# Altium schematic sheet [07] - PCIE MINI.SchDoc
size A2; DocumentNumber: 7; SheetNumber: 7; SheetTotal: 18
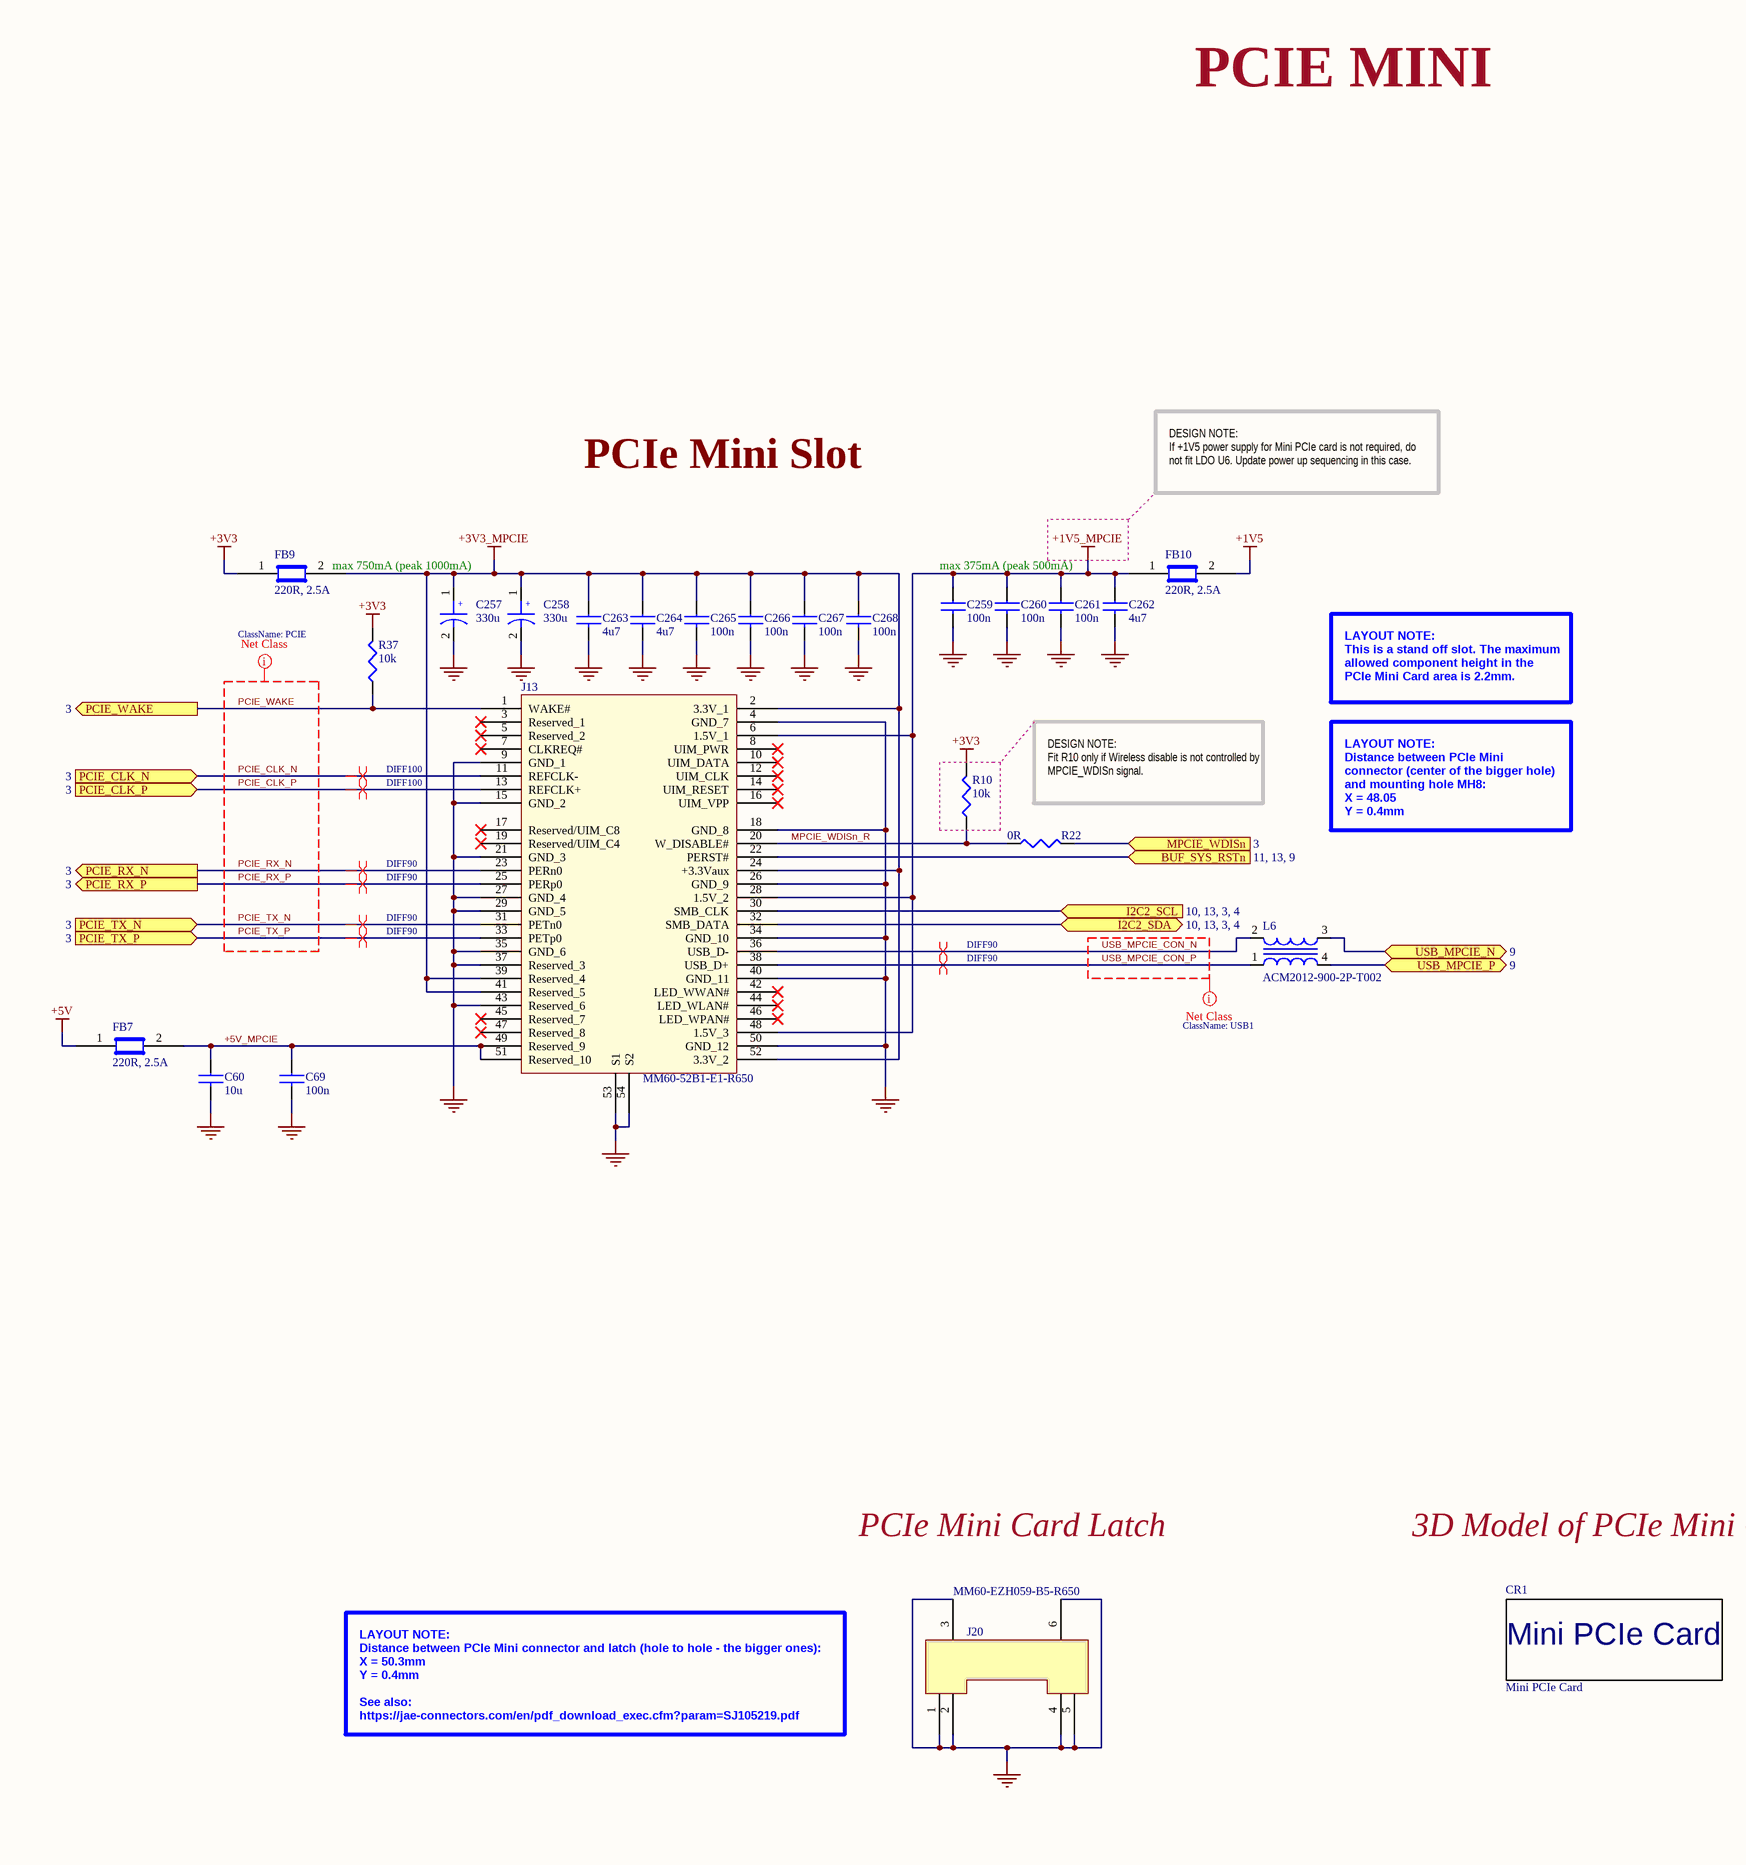
[diagram p0: [07] - PCIE MINI.SchDoc, left]
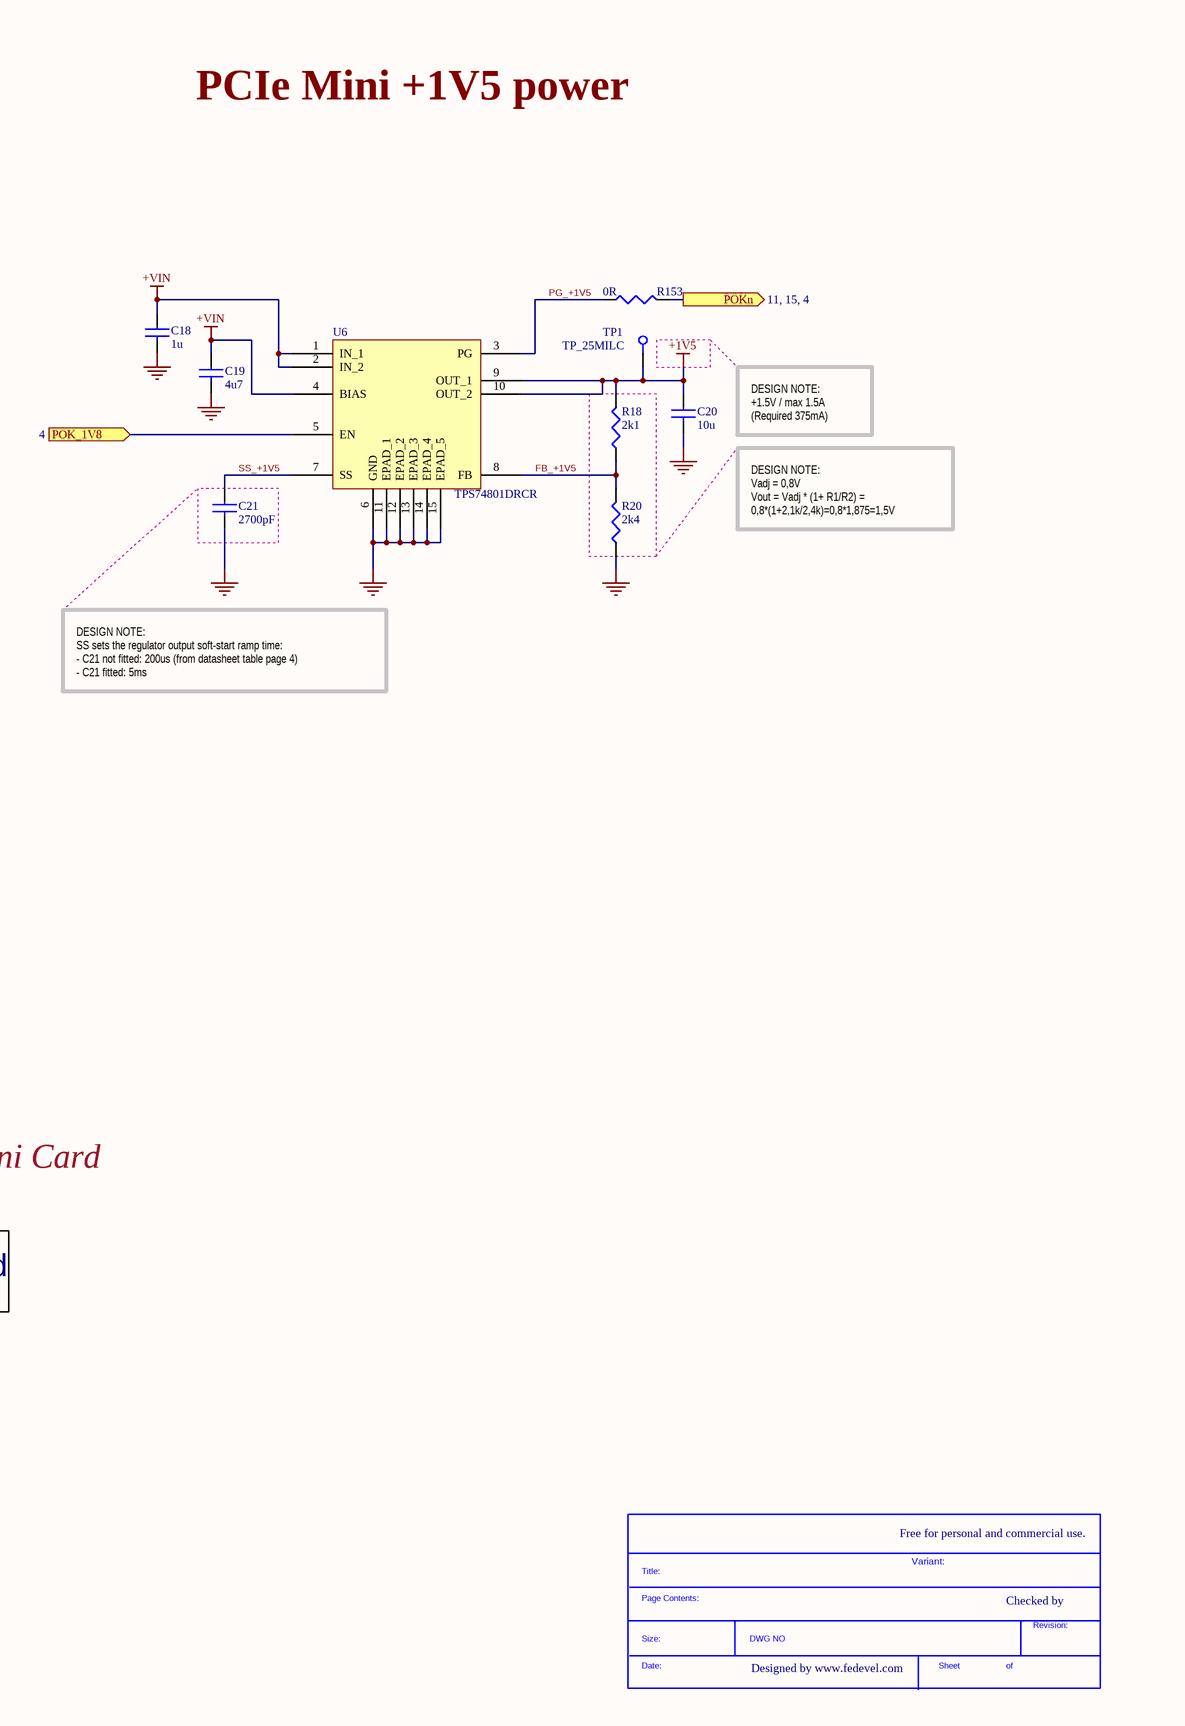
[diagram p1: [07] - PCIE MINI.SchDoc, right]

## Parts
*  SDTitleBlock  (value not drawn)  (graphical)
C18  1u  [C0402]
C19  4u7  [C0402]
C20  10u  [C0603]
C21  2700pF  [C0402]
C60  10u  [C0603]
C69  100n  [C0402]
C257  330u  [C2917]
C258  330u  [C2917]
C259  100n  [C0402]
C260  100n  [C0402]
C261  100n  [C0402]
C262  4u7  [C0402]
C263  4u7  [C0402]
C264  4u7  [C0402]
C265  100n  [C0402]
C266  100n  [C0402]
C267  100n  [C0402]
C268  100n  [C0402]
CR1  Mini PCIe Card  [Mini_PCIe_full card]  (no BOM)
FB7  220R, 2.5A  [C0603]
FB9  220R, 2.5A  [C0603]
FB10  220R, 2.5A  [C0603]
J13  MM60-52B1-E1-R650  [MINI_PCIE_52PIN_CARD_CON]
J20  MM60-EZH059-B5-R650  [MINI_PCIE_52PIN_CARD_LATCH]
L6  ACM2012-900-2P-T002  [ACM2012]
R10  10k  [R0402]
R18  2k1  [R0402]
R20  2k4  [R0402]
R22  0R  [R0402]
R37  10k  [R0402]
R153  0R  [R0402]
TP1  TP_25MILC  [TP_25C]  (no BOM)
U6  TPS74801DRCR  [DRC (S-PVSON-N10)]

## Ports
BUF_SYS_RSTn (see 11, 13, 9), I2C2_SCL (see 10, 13, 3, 4), I2C2_SDA (bidir, see 10, 13, 3, 4), MPCIE_WDISn (in, see 3), PCIE_CLK_N (in, see 3), PCIE_CLK_P (in, see 3), PCIE_RX_N (out, see 3), PCIE_RX_P (out, see 3), PCIE_TX_N (in, see 3), PCIE_TX_P (in, see 3), PCIE_WAKE (out, see 3), POK_1V8 (in, see 4), POKn (see 11, 15, 4), USB_MPCIE_N (bidir, see 9), USB_MPCIE_P (bidir, see 9)

## Nets
+1V5: C20.1 FB10.2 R18.2 TP1.1 U6.9(OUT_1) U6.10(OUT_2)
+1V5_MPCIE: C259.1 C260.1 C261.1 C262.1 FB10.1 J13.6(1.5V_1) J13.28(1.5V_2) J13.48(1.5V_3)
+3V3: FB9.1 R10.2 R37.2
+3V3_MPCIE: C257.1 C258.1 C263.1 C264.1 C265.1 C266.1 C267.1 C268.1 FB9.2 J13.2(3.3V_1) J13.24(+3.3Vaux) J13.39(Reserved_4) J13.41(Reserved_5) J13.52(3.3V_2)
+5V: FB7.1
+VIN: C18.1 C19.1 U6.1(IN_1) U6.2(IN_2) U6.4(BIAS)
GND: C18.2 C19.2 C20.2 C21.2 C60.2 C69.2 C257.2 C258.2 C259.2 C260.2 C261.2 C262.2 C263.2 C264.2 C265.2 C266.2 C267.2 C268.2 J13.4(GND_7) J13.9(GND_1) J13.15(GND_2) J13.18(GND_8) J13.21(GND_3) J13.26(GND_9) J13.27(GND_4) J13.29(GND_5) J13.34(GND_10) J13.35(GND_6) J13.37(Reserved_3) J13.40(GND_11) J13.43(Reserved_6) J13.50(GND_12) J13.53(S1) J13.54(S2) J20.1 J20.2 J20.3 J20.4 J20.5 J20.6 R20.1 U6.6(GND) U6.11(EPAD_1) U6.12(EPAD_2) U6.13(EPAD_3) U6.14(EPAD_4) U6.15(EPAD_5)
+5V_MPCIE: C60.1 C69.1 FB7.2 J13.49(Reserved_9) J13.51(Reserved_10)
BUF_SYS_RSTn: J13.22(PERST#) ; port BUF_SYS_RSTn
FB_+1V5: R18.1 R20.2 U6.8(FB)
I2C2_SCL: J13.30(SMB_CLK) ; port I2C2_SCL
I2C2_SDA: J13.32(SMB_DATA) ; port I2C2_SDA
MPCIE_WDISn: R22.2 ; port MPCIE_WDISn
MPCIE_WDISn_R: J13.20(W_DISABLE#) R10.1 R22.1
PCIE_CLK_N: J13.11(REFCLK-) ; port PCIE_CLK_N
PCIE_CLK_P: J13.13(REFCLK+) ; port PCIE_CLK_P
PCIE_RX_N: J13.23(PERn0) ; port PCIE_RX_N
PCIE_RX_P: J13.25(PERp0) ; port PCIE_RX_P
PCIE_TX_N: J13.31(PETn0) ; port PCIE_TX_N
PCIE_TX_P: J13.33(PETp0) ; port PCIE_TX_P
PCIE_WAKE: J13.1(WAKE#) R37.1 ; port PCIE_WAKE
PG_+1V5: R153.1 U6.3(PG)
POK_1V8: U6.5(EN) ; port POK_1V8
POKn: R153.2 ; port POKn
SS_+1V5: C21.1 U6.7(SS)
USB_MPCIE_CON_N: J13.36(USB_D-) L6.2
USB_MPCIE_CON_P: J13.38(USB_D+) L6.1
USB_MPCIE_N: L6.3 ; port USB_MPCIE_N
USB_MPCIE_P: L6.4 ; port USB_MPCIE_P

Not connected (* = marked no-connect by the designer): J13 3(Reserved_1)* 5(Reserved_2)* 7(CLKREQ#)* 8(UIM_PWR)* 10(UIM_DATA)* 12(UIM_CLK)* 14(UIM_RESET)* 16(UIM_VPP)* 17(Reserved/UIM_C8)* 19(Reserved/UIM_C4)* 42(LED_WWAN#)* 44(LED_WLAN#)* 45(Reserved_7)* 46(LED_WPAN#)* 47(Reserved_8)*

## Layout directives
differential pair; net class DIFF90: PCIE_RX_N, PCIE_RX_P, PCIE_TX_N, PCIE_TX_P, USB_MPCIE_CON_N, USB_MPCIE_CON_P
net class USB1: USB_MPCIE_CON_N, USB_MPCIE_CON_P
differential pair; net class DIFF100: PCIE_CLK_N, PCIE_CLK_P
net class PCIE: PCIE_CLK_N, PCIE_CLK_P, PCIE_RX_N, PCIE_RX_P, PCIE_TX_N, PCIE_TX_P, PCIE_WAKE

## Notes on the sheet
- PCIE MINI
- PCIe Mini Slot
- DESIGN NOTE:
  If +1V5 power supply for Mini PCIe card is not required, do not fit LDO U6. Update power up sequencing in this case.
- PCIe Mini +1V5 power
- max 750mA (peak 1000mA)
- max 375mA (peak 500mA)
- LAYOUT NOTE:
  This is a stand off slot. The maximum allowed component height in the PCIe Mini Card area is 2.2mm.
- (near R22) DESIGN NOTE:
  Fit R10 only if Wireless disable is not controlled by MPCIE_WDISn signal.
- LAYOUT NOTE:
  Distance between PCIe Mini connector (center of the bigger hole) and mounting hole MH8:
  X = 48.05
  Y = 0.4mm
- DESIGN NOTE:
  +1.5V / max 1.5A
  (Required 375mA)
- DESIGN NOTE:
  Vadj = 0,8V
  Vout = Vadj * (1+ R1/R2) = 0,8*(1+2,1k/2,4k)=0,8*1,875=1,5V
- DESIGN NOTE:
  SS sets the regulator output soft-start ramp time:
  - C21 not fitted: 200us (from datasheet table page 4)
  - C21 fitted: 5ms
- PCIe Mini Card Latch
- 3D Model of PCIe Mini Card
- LAYOUT NOTE:
  Distance between PCIe Mini connector and latch (hole to hole - the bigger ones):
  X = 50.3mm
  Y = 0.4mm
  See also:
  https://jae-connectors.com/en/pdf_download_exec.cfm?param=SJ105219.pdf
- Free for personal and commercial use.
- Variant:
- Checked by
- Designed by www.fedevel.com
- (in symbol SDTitleBlock) Title:; Page Contents:; Revision:; Size:; DWG NO; Date:; Sheet; of
- (in symbol T520D337M006ATE045) +

## Library data of the parts
C18 = C1005X5R1C105K: CAP CER 1.0UF 16V X5R 0402; Manufacturer: TDK Corporation; Capacitance: 1.0µF; Value: 1uF; .Checked PCB: used; Tolerance: ±10%; Category: Capacitors; Supplier Part Number: 445-4978-1-ND; Manufacturer Part Number: C1005X5R1C105K; Operating Temperature: -55°C ~ 85°C; Package / Case: 0402 (1005 Metric); Price 1k [$]: 0.02080; .Checked SCH: used; Voltage - Rated: 16V; Supplier: Digikey; Supplier 1: Digi-Key; Supplier Part Number 1: 445-4978-1-ND; RoHS: RoHS Compliant; Stock 1: 341010; Pricing 1: 1=0.24, 10=0.16, 100=0.064, 250=0.046, 500=0.0328, 1000=0.024 (USD); Temperature Coefficient: X5R; Mounting Type: Surface Mount, MLCC; Applications: General Purpose; Ratings: -; Size / Dimension: 0.039" L x 0.020" W (1.00mm x 0.50mm); Height - Seated (Max): -; Thickness (Max): 0.022" (0.55mm); Lead Spacing: -; Features: -; Packaging: Cut Tape (CT); Lead Style: -; ComponentLink1URL: http://www.tdk.co.jp/tefe02/e412_c.pdf; ComponentLink1Description: http://www.tdk.co.jp/tefe02/e412_c.pdf
C19 C262-C264 = C1005X5R1A475M: CAP CER 4.7UF 10V 20% X5R 0402; Manufacturer: TDK Corporation; Capacitance: 4.7µF; .Checked PCB: used; Supplier 1: Digi-Key; Supplier Part Number 1: 445-8023-1-ND; Manufacturer Part Number: C1005X5R1A475M; RoHS: RoHS Compliant; Category: Capacitors; Stock 1: 10140; Pricing 1: 1=0.53, 10=0.415, 100=0.25, 250=0.18752, 500=0.16, 1000=0.125, 5000=0.095 (USD); Voltage - Rated: 10V; Tolerance: ±20%; Temperature Coefficient: X5R; Mounting Type: Surface Mount, MLCC; Operating Temperature: -55°C ~ 85°C; Applications: General Purpose; Ratings: -; Package / Case: 0402 (1005 Metric); Size / Dimension: 0.039" L x 0.020" W (1.00mm x 0.50mm); Height - Seated (Max): -; Thickness (Max): -; Lead Spacing: -; Features: -; Packaging: Cut Tape (CT); Lead Style: -; ComponentLink1URL: http://www.tdk.com/pdf/general_B11.pdf; ComponentLink1Description: http://www.tdk.com/pdf/general_B11.pdf; .Checked SCH: used
C20 C60 = C1608X5R0J106M: CAP CER 10UF 6.3V X5R 20% 0603; Manufacturer: TDK Corporation; Capacitance: 10µF; Value: 10µF; .Checked PCB: used; Category: Capacitors; Supplier Part Number: 445-4112-1-ND; Manufacturer Part Number: C1608X5R0J106M; Operating Temperature: -55°C ~ 85°C; Package / Case: 0603 (1608 Metric); Price 1k [$]: 0.08580; .Checked SCH: used; Voltage - Rated: 6.3V; Features: Low ESR; Supplier: Digikey; Supplier 1: Digi-Key; Supplier Part Number 1: 445-4112-1-ND; RoHS: RoHS Compliant; Stock 1: 48157; Pricing 1: 1=0.46, 10=0.363, 100=0.1898, 250=0.14024, 500=0.1089, 1000=0.0858 (USD); Tolerance: ±20%; Temperature Coefficient: X5R; Mounting Type: Surface Mount, MLCC; Applications: General Purpose; Ratings: -; Size / Dimension: 0.063" L x 0.031" W (1.60mm x 0.80mm); Height - Seated (Max): -; Thickness (Max): 0.037" (0.95mm); Lead Spacing: -; Packaging: Cut Tape (CT); Lead Style: -; ComponentLink1URL: http://www.tdk.com/pdf/general_B11.pdf; ComponentLink1Description: http://www.tdk.com/pdf/general_B11.pdf
C21 = GRM155R71H272KA01D: CAP CER 2700PF 50V 10% X7R 0402; Manufacturer: Murata Electronics North America; .Checked PCB: used; Supplier 1: Digi-Key; Supplier Part Number 1: 490-1306-1-ND; Manufacturer Part Number: GRM155R71H272KA01D; RoHS: RoHS Compliant; Category: Capacitors; Stock 1: 38160; Pricing 1: 10=0.01, 50=0.0086, 100=0.0074, 250=0.00664, 500=0.00618, 750=0.00571, 1000=0.00542 (USD); Capacitance: 2700pF; Voltage - Rated: 50V; Tolerance: ±10%; Temperature Coefficient: X7R; Mounting Type: Surface Mount, MLCC; Operating Temperature: -55°C ~ 125°C; Applications: General Purpose; Ratings: -; Package / Case: 0402 (1005 Metric); Size / Dimension: 0.039" L x 0.020" W (1.00mm x 0.50mm); Height - Seated (Max): -; Thickness (Max): 0.022" (0.55mm); Lead Spacing: -; Features: -; Packaging: Cut Tape (CT); Lead Style: -; ComponentLink1URL: http://search.murata.co.jp/Ceramy/image/img/PDF/ENG/GRM155R71H272KA01.pdf; ComponentLink1Description: http://search.murata.co.jp/Ceramy/image/img/PDF/ENG/GRM155R71H272KA01.pdf; .Checked SCH: used
C69 C259-C261 C265-C268 = C1005X5R1H104K: CAP CER .10UF 50V X5R 10% 0402; Manufacturer: TDK Corporation; Capacitance: 0.1µF; Value: 100nF; .Checked PCB: used; Category: Capacitors; Supplier Part Number: 445-5942-1-ND; Manufacturer Part Number: C1005X5R1H104K; Operating Temperature: -55°C ~ 85°C; Package / Case: 0402 (1005 Metric); Price 1k [$]: 0.02340; .Checked SCH: used; Voltage - Rated: 50V; Supplier: Digikey; Supplier 1: Digi-Key; Supplier Part Number 1: 445-5942-1-ND; RoHS: RoHS Compliant; Stock 1: 106926; Pricing 1: 1=0.27, 10=0.18, 100=0.072, 250=0.05176, 500=0.0369, 1000=0.027 (USD); Tolerance: ±10%; Temperature Coefficient: X5R; Mounting Type: Surface Mount, MLCC; Applications: General Purpose; Ratings: -; Size / Dimension: 0.039" L x 0.020" W (1.00mm x 0.50mm); Height - Seated (Max): -; Thickness (Max): 0.022" (0.55mm); Lead Spacing: -; Features: -; Packaging: Cut Tape (CT); Lead Style: -; ComponentLink1URL: http://www.tdk.co.jp/tefe02/e412_c.pdf; ComponentLink1Description: http://www.tdk.co.jp/tefe02/e412_c.pdf
C257 C258 = T520D337M006ATE045: CAP TANT 330UF 6.3V 20% 2917; Manufacturer: Kemet; Manufacturer Size Code: D; Capacitance: 330µF; ESR (Equivalent Series Resistance): 45 mOhm; Type: Molded; .Creator: MM; .Checked PCB: used; Supplier 1: Digi-Key; Manufacturer Part Number: T520D337M006ATE045; RoHS: RoHS Compliant; Category: Capacitors; Stock 1: 11758; Pricing 1: 1=1.33, 10=1.05, 50=0.91, 100=0.7875, 250=0.7 (USD); Packaging: Cut Tape (CT); Voltage - Rated: 6.3V; Tolerance: ±20%; Operating Temperature: -55°C ~ 105°C; Mounting Type: Surface Mount; Package / Case: 2917 (7343 Metric); Size / Dimension: 0.287" L x 0.169" W (7.30mm x 4.30mm); Height - Seated (Max): 0.122" (3.10mm); Lead Spacing: -; Features: Polymer; Lifetime @ Temp.: -; ComponentLink1URL: http://www.kemet.com/kemet/web/homepage/kechome.nsf/file/T520%20Series/$file/KEM_T2015_T520.pdf; ComponentLink1Description: http://www.kemet.com/kemet/web/homepage/kechome.nsf/file/T520%20Series/$file/KEM_T2015_T520.pdf; Supplier Part Number 1: 399-4055-1-ND; .Checked SCH: used
CR1 = Card_Mini_PCIe: Card MIni PCIe; .Creator: MM; Category: Card
FB7 FB9 FB10 = BLM18SG221TN1D: FERRITE CHIP 220 OHM 2500MA 0603; Manufacturer: Murata Electronics North America; Impedance @ Frequency: 220 Ohm @ 100MHz; DC Resistance (DCR): 40 mOhm Max; Filter Type: Differential Mode - Single; Number of Lines: 1; .Checked PCB: used; Supplier 1: Digi-Key; Supplier Part Number 1: 490-5225-1-ND; Manufacturer Part Number: BLM18SG221TN1D; RoHS: RoHS Compliant; Category: Filters; Stock 1: 54640; Pricing 1: 1=0.38, 10=0.282, 50=0.1646, 100=0.1316, 250=0.094, 500=0.06392, 1000=0.0517, 5000=0.04042 (USD); Current Rating: 2.5A; Package / Case: 0603 (1608 Metric); Mounting Type: Surface Mount; Packaging: Cut Tape (CT); Height (Max): 0.037" (0.95mm); Size / Dimension: 0.063" L x 0.031" W (1.60mm x 0.80mm); ComponentLink1URL: http://search.murata.co.jp/Ceramy/image/img/PDF/ENG/L0110S0100BLM18S.pdf; ComponentLink1Description: http://search.murata.co.jp/Ceramy/image/img/PDF/ENG/L0110S0100BLM18S.pdf; .Checked SCH: used
J13 = MM60-52B1-E1-R650: CONN MINI EXPRESS CARD 52POS SMD; Manufacturer: JAE Electronics; Card Type: PCI Express Mini Card; Gender: Female; Number of Positions: 52; Card Thickness: 0.039" (1.00mm); Pitch: 0.031" (0.80mm); Material - Insulation: Thermoplastic; Read Out: Dual; .Creator: MM; .Checked PCB: used; Supplier 1: Digi-Key; Manufacturer Part Number: MM60-52B1-E1-R650; RoHS: RoHS Compliant; Category: Connectors, Interconnects; Stock 1: 470; Pricing 1: 1=2.16, 10=1.962, 25=1.842, 100=1.6817, 250=1.52152 (USD); Packaging: Cut Tape (CT); Number of Positions/Bay/Row: -; Number of Rows: 2; Features: Board Guide; Mounting Type: Surface Mount, Right Angle; Termination: Solder; Contact Material: Copper Alloy; Contact Finish: Gold; Contact Finish Thickness: 4µin (0.10µm); Contact Type: -; Color: -; Flange Feature: -; Operating Temperature: -40°C ~ 85°C; ComponentLink1URL: http://jae-connectors.com/en/pdf/JACS-10313_MM60.pdf; ComponentLink1Description: http://jae-connectors.com/en/pdf/JACS-10313_MM60.pdf; Supplier Part Number 1: 670-2275-1-ND; .Checked SCH: used
J20 = MM60-EZH059-B5-R650: CONN MINI EXPRESS CARD LATCH SMD; Manufacturer: JAE Electronics; For Use With/Related Products: PCI Express Mini Card; .Creator: MM; .Checked PCB: used; Supplier 1: Digi-Key; Manufacturer Part Number: MM60-EZH059-B5-R650; RoHS: RoHS Compliant; Category: Connectors, Interconnects; Stock 1: 4853; Pricing 1: 1=1.22, 10=1.075, 25=1.0116, 100=0.9272, 250=0.84292 (USD); Packaging: Cut Tape (CT); Accessory Type: Latch; ComponentLink1URL: http://jae-connector.com/en/pdf/SJ105221.pdf; ComponentLink1Description: http://jae-connector.com/en/pdf/SJ105221.pdf; Supplier Part Number 1: 670-2277-1-ND; .Checked SCH: used
L6 = ACM2012-900-2P-T002: CHOKE COMM MODE 90 OHM .4A SMD; Manufacturer: TDK Corporation; Filter Type: Data, Signal Line; Number of Lines: 2; Current: 400mA; DC Resistance (DCR): 190 mOhm Max; Impedance: 90 Ohm; Resistance (Ohms): 8.2K; Power (Watts): 0.063W, 1/16W; Temperature Coefficient: ±100ppm/°C; Tolerance: ±1%; .Checked PCB: used; Supplier 1: Digi-Key; Supplier Part Number 1: 445-2207-1-ND; Manufacturer Part Number: ACM2012-900-2P-T002; RoHS: RoHS Compliant; Category: Filters; Stock 1: 175768; Pricing 1: 1=0.48, 10=0.448, 50=0.42, 100=0.364, 500=0.308, 1000=0.252 (USD); Inductance: -; Mounting Type: Surface Mount; Size / Dimension: 0.079" L x 0.047" W (2.00mm x 1.20mm); Height (Max): 0.051" (1.30mm); Package / Case: 0805 (2012 Metric), 4 Lead; Operating Temperature: -25°C ~ 85°C; Packaging: Cut Tape (CT); ComponentLink1URL: http://www.tdk.co.jp/tefe02/e9719_acm2012.pdf; ComponentLink1Description: http://www.tdk.co.jp/tefe02/e9719_acm2012.pdf; Composition: Thick Film; Features: -; Height: 0.016" (0.40mm); Number of Terminations: 2; ComponentLink2URL: http://www.yageo.com/documents/recent/PYu-RC0402_51_RoHS_L_6.pdf; ComponentLink2Description: http://www.yageo.com/documents/recent/PYu-RC0402_51_RoHS_L_6.pdf; .Checked SCH: used
R10 R37 = RC0402FR-0710KL: RES 10.0K OHM 1/16W 1% 0402 SMD; Manufacturer: Yageo; Power (Watts): 0.063W, 1/16W; .Checked PCB: used; Temperature Coefficient: ±100ppm/°C; Category: Resistors; Supplier Part Number: 311-10.0KLRCT-ND; Manufacturer Part Number: RC0402FR-0710KL; Package / Case: 0402 (1005 Metric); Price 1k [$]: 0.01421; Resistance (Ohms): 10K; Tolerance: ±1%; Value: 10k; .Checked SCH: used; Supplier: Digikey; Supplier 1: Digi-Key; Supplier Part Number 1: 311-10.0KLRCT-ND; RoHS: RoHS Compliant; Stock 1: 2916495; Pricing 1: 10=0.014, 50=0.0104, 100=0.0079, 250=0.00584, 500=0.00432, 1000=0.00288 (USD); Composition: Thick Film; Features: -; Size / Dimension: 0.039" L x 0.020" W (1.00mm x 0.50mm); Height: 0.016" (0.40mm); Number of Terminations: 2; Packaging: Cut Tape (CT); ComponentLink1URL: http://www.yageo.com/documents/recent/PYu-RC0402_51_RoHS_L_6.pdf; ComponentLink1Description: http://www.yageo.com/documents/recent/PYu-RC0402_51_RoHS_L_6.pdf
R18 = CRCW04022K10FKED: RES 2.10K OHM 1/16W 1% 0402 SMD; Manufacturer: Vishay Dale; Resistance (Ohms): 2.1k; Power (Watts): 0.063W, 1/16W; Temperature Coefficient: ±100ppm/°C; .Creator: MM; .Checked PCB: used; Supplier 1: Digi-Key; Manufacturer Part Number: CRCW04022K10FKED; RoHS: RoHS Compliant; Category: Resistors; Stock 1: 65680; Pricing 1: 10=0.083, 50=0.0444, 200=0.0255, 1000=0.0174 (USD); Packaging: Cut Tape (CT); Tolerance: ±1%; Composition: Thick Film; Features: Automotive AEC-Q200 Qualified; Package / Case: 0402 (1005 Metric); Supplier Device Package: 0402 (1005 Metric); Size / Dimension: 0.039" L x 0.020" W (1.00mm x 0.50mm); Height: 0.016" (0.40mm); Number of Terminations: 2; ComponentLink1URL: http://www.vishay.com/doc?20035; ComponentLink1Description: http://www.vishay.com/doc?20035; Supplier Part Number 1: 541-2.10KLCT-ND; .Checked SCH: used
R20 = CRCW04022K40FKED: RES 2.40K OHM 1/16W 1% 0402 SMD; Manufacturer: Vishay Dale; Resistance (Ohms): 2.4K; Power (Watts): 0.063W, 1/16W; Temperature Coefficient: ±100ppm/°C; .Checked PCB: used; Supplier 1: Digi-Key; Supplier Part Number 1: 541-2.40KLCT-ND; Manufacturer Part Number: CRCW04022K40FKED; RoHS: RoHS Compliant; Category: Resistors; Stock 1: 43967; Pricing 1: 10=0.083, 50=0.0444, 200=0.0255, 1000=0.0174 (USD); Composition: Thick Film; Features: -; Tolerance: ±1%; Package / Case: 0402 (1005 Metric); Size / Dimension: 0.039" L x 0.020" W (1.00mm x 0.50mm); Height: 0.016" (0.40mm); Number of Terminations: 2; Packaging: Cut Tape (CT); ComponentLink1URL: http://www.vishay.com/doc?20035; ComponentLink1Description: http://www.vishay.com/doc?20035; .Checked SCH: used
R22 R153 = RC0402JR-070RL: RES 0.0 OHM 1/16W 0402 SMD; Manufacturer: Yageo; Resistance (Ohms): 0.0; Power (Watts): 0.063W, 1/16W; Tolerance: Jumper; .Checked PCB: used; Category: Resistors; Manufacturer Part Number: RC0402JR-070RL; Package / Case: 0402 (1005 Metric); Price 1k [$]: 0.01389; Value: 0R; .Checked SCH: used; Supplier Part Number: 311-0.0JRCT-ND; Supplier: Digikey; Supplier 1: Digi-Key; Supplier Part Number 1: 311-0.0JRCT-ND; RoHS: RoHS Compliant; Stock 1: 1106330; Pricing 1: 10=0.012, 50=0.009, 100=0.0069, 250=0.00512, 500=0.0038, 1000=0.00253 (USD); Composition: Thick Film; Features: -; Temperature Coefficient: -; Size / Dimension: 0.039" L x 0.020" W (1.00mm x 0.50mm); Height: 0.016" (0.40mm); Number of Terminations: 2; Packaging: Cut Tape (CT); ComponentLink1URL: http://www.yageo.com/documents/recent/PYu-RC0402_51_RoHS_L_6.pdf; ComponentLink1Description: http://www.yageo.com/documents/recent/PYu-RC0402_51_RoHS_L_6.pdf
TP1 = TP_25MILC: Test Point 25mil
U6 = TPS74801DRCR: IC REG LDO ADJ 1.5A 10SON; Manufacturer: Texas Instruments; Number of Regulators: 1; Regulator Topology: Positive Adjustable; Voltage - Input: 0.8 V ~ 5.5 V; Voltage - Output: 0.8 V ~ 3.6 V; Voltage - Dropout (Typical): 0.06V @ 1.5A; Current - Output: 1.5A (Max); Current - Limit (Min): 2A; .Creator: MM; .Checked PCB: used; Supplier 1: Digi-Key; Manufacturer Part Number: TPS74801DRCR; RoHS: RoHS Compliant; Category: Integrated Circuits (ICs); Stock 1: 11680; Pricing 1: 1=2.3, 10=2.074, 25=1.8576, 100=0.972, 250=0.954, 500=0.936, 750=0.918 (USD); Packaging: Cut Tape (CT); Operating Temperature: -40°C ~ 125°C; Mounting Type: Surface Mount; Package / Case: 10-VFDFN Exposed Pad; Supplier Device Package: 10-SON (3x3); ComponentLink1URL: http://www.ti.com/lit/ds/symlink/tps74801.pdf; ComponentLink1Description: http://www.ti.com/lit/ds/symlink/tps74801.pdf; Supplier Part Number 1: 296-21563-1-ND; .Checked SCH: used